# EAGLE design downlink_16_yobi (EAGLE 7.2.0)
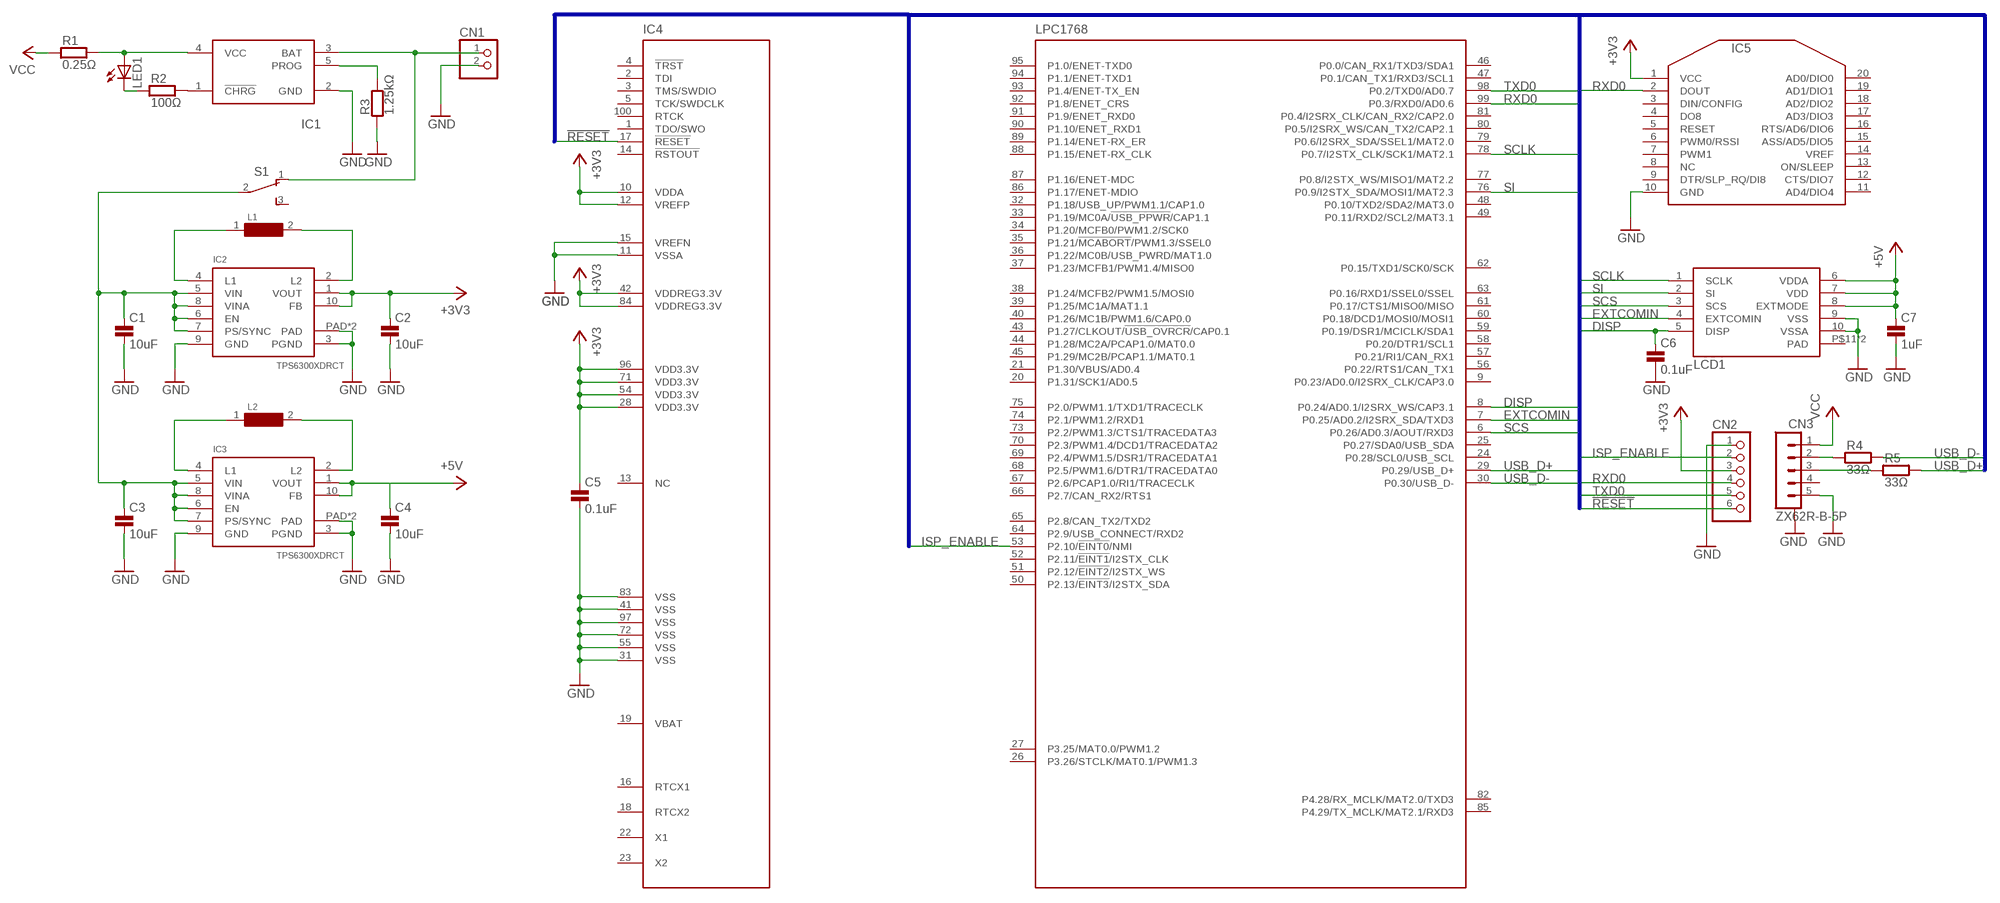
[diagram p0: schematic, sheet 1]

## Parts
C1  10uF  C0603  [0603]
C2  10uF  C0603  [0603]
C3  10uF  C0603  [0603]
C4  10uF  C0603  [0603]
C5  0.1uF  C0603  [0603]
C6  0.1uF  C0603  [0603]
C7  1uF  C0603  [0603]
CN1  PINHD-1X2  [1X02]
CN2  PINHD-1X6/90  [1X06/90]
CN3  ZX62R-B-5P  [MICRO-B]
IC1  LTC4054  [TSOT23-5]
IC2  TPS6300XDRCT  [S-PVSON-N10]
IC3  TPS6300XDRCT  [S-PVSON-N10]
IC4  LPC1768  [LQFP100]
IC5  XBEE-PRO2MM  [XBEE-ZB]
L1  VLF4012ST  [VLF4012ST]
L2  VLF4012ST  [VLF4012ST]
LCD1  LS027B4DH01SMD  [FH12-10S-0.5SH]
LED1  LEDSML0603  [SML0603]
R1  0.25Ω  R0603  [0603]
R2  100Ω  R0603  [0603]
R3  1.25kΩ  R0603  [0603]
R4  33Ω  R0603  [0603]
R5  33Ω  R0603  [0603]
S1  SS-12D00  [SS-12D00]

## Nets
!RESET!: CN2.6 IC4.17(!RESET!)
+3V3: C2.1 C5.1 CN2.3 IC2.1(VOUT) IC2.10(FB) IC4.10(VDDA) IC4.12(VREFP) IC4.28(VDD3.3V) IC4.42(VDDREG3.3V) IC4.54(VDD3.3V) IC4.71(VDD3.3V) IC4.84(VDDREG3.3V) IC4.96(VDD3.3V) IC5.1(VCC)
+5V: C4.1 C7.1 IC3.1(VOUT) IC3.10(FB) LCD1.6(VDDA) LCD1.7(VDD) LCD1.8(EXTMODE)
DISP: C6.1 IC4.8(P0.24/AD0.1/I2SRX_WS/CAP3.1) LCD1.5(DISP)
EXTCOMIN: IC4.7(P0.25/AD0.2/I2SRX_SDA/TXD3) LCD1.4(EXTCOMIN)
GND: C1.2 C2.2 C3.2 C4.2 C5.2 C6.2 C7.2 CN1.2 CN2.1 CN3.5(1.VBUS) CN3.CASE@1 CN3.CASE@2 CN3.CASE@3 CN3.CASE@4 IC1.2(GND) IC2.3(PGND) IC2.9(GND) IC2.PAD IC2.PAD@1(PAD) IC3.3(PGND) IC3.9(GND) IC3.PAD IC3.PAD@1(PAD) IC4.11(VSSA) IC4.15(VREFN) IC4.31(VSS) IC4.41(VSS) IC4.55(VSS) IC4.72(VSS) IC4.83(VSS) IC4.97(VSS) IC5.10(GND) LCD1.9(VSS) LCD1.10(VSSA) R3.1
ISP_ENABLE: CN2.2 IC4.53(P2.10/!EINT0!/NMI)
N$1: CN3.2(4.ID) R4.1
N$2: CN3.3(3.D+) R5.1
N$3: IC1.5(PROG) R3.2
N$4: IC1.4(VCC) LED1.A R1.2
N$5: CN1.1 IC1.3(BAT) S1.1(O)
N$6: IC1.1(!CHRG!) R2.2
N$7: LED1.C R2.1
N$8: IC2.4(L1) L1.1
N$9: IC2.2(L2) L1.2
N$11: IC3.4(L1) L2.1
N$12: IC3.2(L2) L2.2
N$13: C1.1 C3.1 IC2.5(VIN) IC2.6(EN) IC2.7(PS/SYNC) IC2.8(VINA) IC3.5(VIN) IC3.6(EN) IC3.7(PS/SYNC) IC3.8(VINA) S1.2(P)
RXD0: CN2.4 IC4.99(P0.3/RXD0/AD0.6) IC5.2(DOUT)
SCLK: IC4.78(P0.7/I2STX_CLK/SCK1/MAT2.1) LCD1.1(SCLK)
SCS: IC4.6(P0.26/AD0.3/AOUT/RXD3) LCD1.3(SCS)
SI: IC4.76(P0.9/I2STX_SDA/MOSI1/MAT2.3) LCD1.2(SI)
TXD0: CN2.5 IC4.98(P0.2/TXD0/AD0.7)
USB_D+: IC4.29(P0.29/USB_D+) R5.2
USB_D-: IC4.30(P0.30/USB_D-) R4.2
VCC: CN3.1(5.GND) R1.1
Unconnected: CN3.4(2.D-) IC4.1(TDO/SWO) IC4.2(TDI) IC4.3(TMS/SWDIO) IC4.4(!TRST!) IC4.5(TCK/SWDCLK) IC4.9(P0.23/AD0.0/I2SRX_CLK/CAP3.0) IC4.13(NC) IC4.14(!RSTOUT!) IC4.16(RTCX1) IC4.18(RTCX2) IC4.19(VBAT) IC4.20(P1.31/SCK1/AD0.5) IC4.21(P1.30/VBUS/AD0.4) IC4.22(X1) IC4.23(X2) IC4.24(P0.28/SCL0/USB_SCL) IC4.25(P0.27/SDA0/USB_SDA) IC4.26(P3.26/STCLK/MAT0.1/PWM1.3) IC4.27(P3.25/MAT0.0/PWM1.2) IC4.32(P1.18/USB_UP/PWM1.1/CAP1.0) IC4.33(P1.19/MC0A/!USB_PPWR!/CAP1.1) IC4.34(P1.20/MCFB0/PWM1.2/SCK0) IC4.35(P1.21/!MCABORT!/PWM1.3/SSEL0) IC4.36(P1.22/MC0B/USB_PWRD/MAT1.0) IC4.37(P1.23/MCFB1/PWM1.4/MISO0) IC4.38(P1.24/MCFB2/PWM1.5/MOSI0) IC4.39(P1.25/MC1A/MAT1.1) IC4.40(P1.26/MC1B/PWM1.6/CAP0.0) IC4.43(P1.27/CLKOUT/!USB_OVRCR!/CAP0.1) IC4.44(P1.28/MC2A/PCAP1.0/MAT0.0) IC4.45(P1.29/MC2B/PCAP1.1/MAT0.1) IC4.46(P0.0/CAN_RX1/TXD3/SDA1) IC4.47(P0.1/CAN_TX1/RXD3/SCL1) IC4.48(P0.10/TXD2/SDA2/MAT3.0) IC4.49(P0.11/RXD2/SCL2/MAT3.1) IC4.50(P2.13/!EINT3!/I2STX_SDA) IC4.51(P2.12/!EINT2!/I2STX_WS) IC4.52(P2.11/!EINT1!/I2STX_CLK) IC4.56(P0.22/RTS1/CAN_TX1) IC4.57(P0.21/RI1/CAN_RX1) IC4.58(P0.20/DTR1/SCL1) IC4.59(P0.19/DSR1/MCICLK/SDA1) IC4.60(P0.18/DCD1/MOSI0/MOSI1) IC4.61(P0.17/CTS1/MISO0/MISO) IC4.62(P0.15/TXD1/SCK0/SCK) IC4.63(P0.16/RXD1/SSEL0/SSEL) IC4.64(P2.9/USB_CONNECT/RXD2) IC4.65(P2.8/CAN_TX2/TXD2) IC4.66(P2.7/CAN_RX2/RTS1) IC4.67(P2.6/PCAP1.0/RI1/TRACECLK) IC4.68(P2.5/PWM1.6/DTR1/TRACEDATA0) IC4.69(P2.4/PWM1.5/DSR1/TRACEDATA1) IC4.70(P2.3/PWM1.4/DCD1/TRACEDATA2) IC4.73(P2.2/PWM1.3/CTS1/TRACEDATA3) IC4.74(P2.1/PWM1.2/RXD1) IC4.75(P2.0/PWM1.1/TXD1/TRACECLK) IC4.77(P0.8/I2STX_WS/MISO1/MAT2.2) IC4.79(P0.6/I2SRX_SDA/SSEL1/MAT2.0) IC4.80(P0.5/I2SRX_WS/CAN_TX2/CAP2.1) IC4.81(P0.4/I2SRX_CLK/CAN_RX2/CAP2.0) IC4.82(P4.28/RX_MCLK/MAT2.0/TXD3) IC4.85(P4.29/TX_MCLK/MAT2.1/RXD3) IC4.86(P1.17/ENET-MDIO) IC4.87(P1.16/ENET-MDC) IC4.88(P1.15/ENET-RX_CLK) IC4.89(P1.14/ENET-RX_ER) IC4.90(P1.10/ENET_RXD1) IC4.91(P1.9/ENET_RXD0) IC4.92(P1.8/ENET_CRS) IC4.93(P1.4/ENET-TX_EN) IC4.94(P1.1/ENET-TXD1) IC4.95(P1.0/ENET-TXD0) IC4.100(RTCK) IC5.3(DIN/CONFIG) IC5.4(DO8) IC5.5(RESET) IC5.6(PWM0/RSSI) IC5.7(PWM1) IC5.8(NC) IC5.9(DTR/SLP_RQ/DI8) IC5.11(AD4/DIO4) IC5.12(CTS/DIO7) IC5.13(ON/SLEEP) IC5.14(VREF) IC5.15(ASS/AD5/DIO5) IC5.16(RTS/AD6/DIO6) IC5.17(AD3/DIO3) IC5.18(AD2/DIO2) IC5.19(AD1/DIO1) IC5.20(AD0/DIO0) LCD1.P$11(PAD) LCD1.P$12(PAD) S1.3(S)

## Buses
SCLK,SI,SCS,EXTCOMIN,DISP,RXD0,TXD0,!RESET!,ISP_ENABLE,USB_D+,USB_D-

## Library data of the parts
C1-C7 = untitled:C: CAPACITOR
CN1 = pinhead:PINHD-1X2: PIN HEADER
CN2 = pinhead:PINHD-1X6: PIN HEADER
CN3 = untitled:ZX62R-B-5P
IC1 = untitled:LTC4054
IC2 IC3 = untitled:TPS6300XDRCT
IC4 = untitled:LPC1768
IC5 = untitled:XBEE-PRO: XBee
L1 L2 = untitled:VLF4012ST
LCD1 = untitled:LS027B4DH01: LCD
LED1 = led:LED: LED OSRAM: - CHIPLED LG R971, LG N971, LY N971, LG Q971, LY Q971, LO R971, LY R971 LH N974, LH R974 LS Q976, LO Q976, LY Q976 LO Q996 - Hyper CHIPLED LW Q18S LB Q993, LB Q99A, LB R99A - SideLED LS A670, LO A670, LY A670, LG A670, LP A670 LB A673, LV A673, LT A673, LW A673 LH A674 LY A675 LS A676, LA A676, LO A676, LY A676, LW A676 LS A679, LY A679, LG A679 - Hyper Micro SIDELED® LS Y876, LA Y876, LO Y876, LY Y876 LT Y87S - SmartLED LW L88C, LW L88S LB L89C, LB L89S, LG L890 LS L89K, LO L89K, LY L89K LS L896, LA L896, LO L896, LY L896 - TOPLED LS T670, LO T670, LY T670, LG T670, LP T670 LSG T670, LSP T670, LSY T670, LOP T670, LYG T670 LG T671, LOG T671, LSG T671 LB T673, LV T673, LT T673, LW T673 LH T674 LS T676, LA T676, LO T676, LY T676, LB T676, LH T676, LSB T676, LW T676 LB T67C, LV T67C, LT T67C, LS T67K, LO T67K, LY T67K, LW E67C LS E67B, LA E67B, LO E67B, LY E67B, LB E67C, LV E67C, LT E67C LW T67C LS T679, LY T679, LG T679 LS T770, LO T770, LY T770, LG T770, LP T770 LB T773, LV T773, LT T773, LW T773 LH T774 LS E675, LA E675, LY E675, LS T675 LS T776, LA T776, LO T776, LY T776, LB T776 LHGB T686 LT T68C, LB T68C - Hyper Mini TOPLED® LB M676 - Mini TOPLED Santana® LG M470 LS M47K, LO M47K, LY M47K Source: http://www.osram.convergy.de LUXEON: - LUMILED® LXK2-PW12-R00, LXK2-PW12-S00, LXK2-PW14-U00, LXK2-PW14-V00 LXK2-PM12-R00, LXK2-PM12-S00, LXK2-PM14-U00 LXK2-PE12-Q00, LXK2-PE12-R00, LXK2-PE12-S00, LXK2-PE14-T00, LXK2-PE14-U00 LXK2-PB12-K00, LXK2-PB12-L00, LXK2-PB12-M00, LXK2-PB14-N00, LXK2-PB14-P00, LXK2-PB14-Q00 LXK2-PR12-L00, LXK2-PR12-M00, LXK2-PR14-Q00, LXK2-PR14-R00 LXK2-PD12-Q00, LXK2-PD12-R00, LXK2-PD12-S00 LXK2-PH12-R00, LXK2-PH12-S00 LXK2-PL12-P00, LXK2-PL12-Q00, LXK2-PL12-R00 Source: www.luxeon.com KINGBRIGHT: KA-3528ASYC Source: www.kingbright.com
R1-R5 = untitled:R: RESISTOR
S1 = switch-slide:SS-12D00: SLIDE SWITCH

## Board
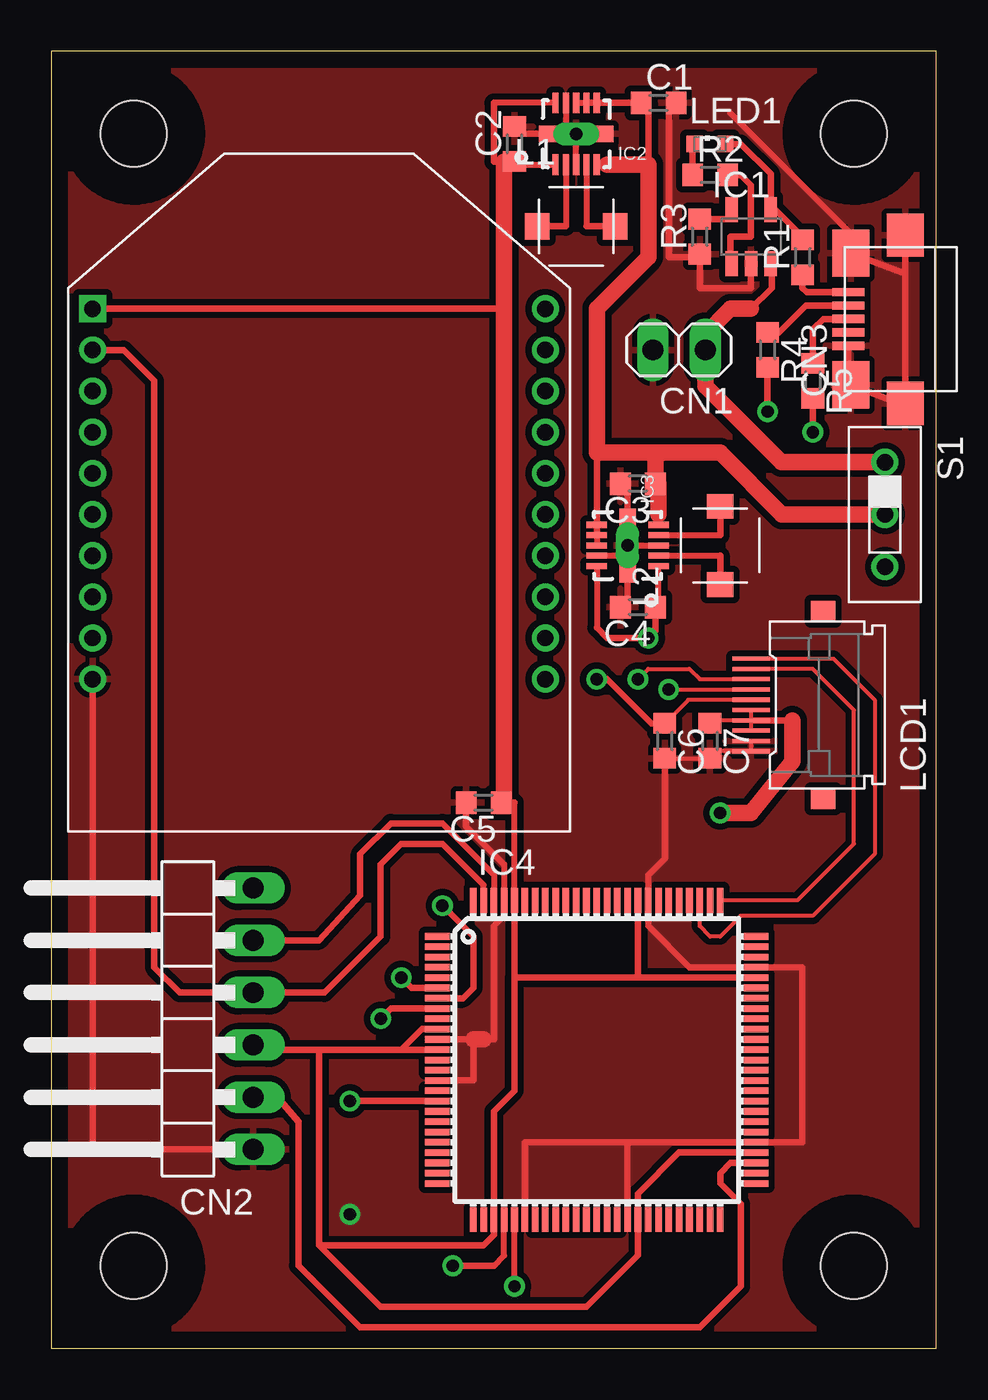
[diagram p1: board, top side]
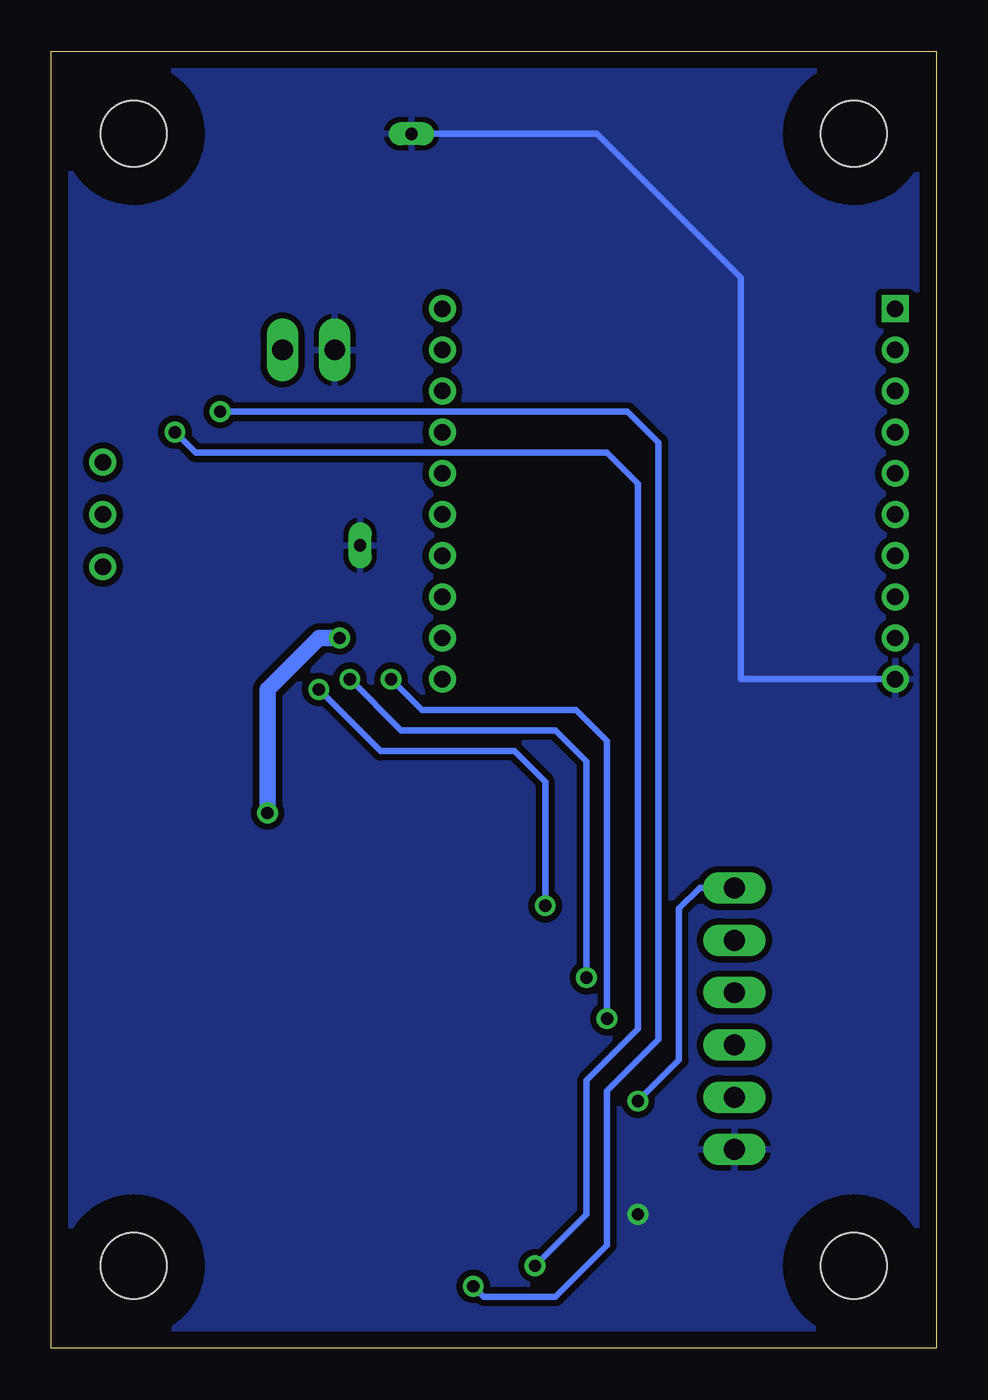
[diagram p2: board, bottom side, seen from below]

Size 43 x 63 mm. Coordinates in mm from the lower left corner, seen from the top.
Outline: 0,0 43,0 43,63 0,63 0,0
Copper layers (1*16): Top 0.035mm / dielectric 1.5mm / Bottom 0.035mm
Design rules "default *": minimum track width 10mil, minimum drill 0.6mm, track to track 0.2mm, track to pad 0.2mm, pad to pad 0.2mm, via to via 0.2mm, smd to smd 0.2mm, copper to edge 32mil, drill to drill 8mil, minimum pad ring 10mil, minimum via ring 8mil, stop-mask expansion 4mil, vias tented up to drill 0mil, thermal gap 10mil
Holes 3.2 mm at 39,59 39,4 4,4 4,59
tRestrict: area 36,56 to 42,62; area 36,1 to 42,7; area 1,1 to 7,7; area 1,56 to 7,62
bRestrict: area 1,1 to 7,7; area 1,56 to 7,62; area 36,56 to 42,62; area 36,1 to 42,7

### Footprints (pad centres in the part's own frame; a part is rotated, then mirrored left to right if it is on the bottom)
0603 = smd 1 x 1.1: 1 -0.85,0; 2 0.85,0
1X02 = drill 1.016 long: 1 -1.27,0; 2 1.27,0
1X06/90 = drill 1.016 long: 1 -6.35,-3.81; 2 -3.81,-3.81; 3 -1.27,-3.81; 4 1.27,-3.81; 5 3.81,-3.81; 6 6.35,-3.81
MICRO-B = smd 0.4 x 1.55: 1 1.3,2.775; 2 0.65,2.775; 3 0,2.775; 4 -0.65,2.775; 5 -1.3,2.775 | smd 2.3 x 1.8: CASE@1 -3.2,2.65; CASE@2 3.2,2.65 | smd 2.1 x 1.8: CASE@3 -4.1,0; CASE@4 4.075,0
TSOT23-5 = smd 0.62 x 1.22: 1 -0.95,-1.31; 2 0,-1.31; 3 0.95,-1.31; 4 0.95,1.31; 5 -0.95,1.31
S-PVSON-N10 = smd 0.3 x 1: 1 -1,-1.5; 2 -0.5,-1.5; 3 0,-1.5; 4 0.5,-1.5; 5 1,-1.5; 6 1,1.5; 7 0.5,1.5; 8 0,1.5; 9 -0.5,1.5; 10 -1,1.5 | smd 3.6 x 0.8: PAD 0,0 | drill 0.6 long: PAD@1 0,0
LQFP100 = smd 1.2 x 0.32: 1 -7.75,6; 2 -7.75,5.5; 3 -7.75,5; 4 -7.75,4.5; 5 -7.75,4; 6 -7.75,3.5; 7 -7.75,3; 8 -7.75,2.5; 9 -7.75,2; 10 -7.75,1.5; 11 -7.75,1; 12 -7.75,0.5; 13 -7.75,0; 14 -7.75,-0.5; 15 -7.75,-1; 16 -7.75,-1.5; 17 -7.75,-2; 18 -7.75,-2.5; 19 -7.75,-3; 20 -7.75,-3.5; 21 -7.75,-4; 22 -7.75,-4.5; 23 -7.75,-5; 24 -7.75,-5.5; 25 -7.75,-6; 51 7.75,-6; 52 7.75,-5.5; 53 7.75,-5; 54 7.75,-4.5; 55 7.75,-4; 56 7.75,-3.5; 57 7.75,-3; 58 7.75,-2.5; 59 7.75,-2; 60 7.75,-1.5; 61 7.75,-1; 62 7.75,-0.5; 63 7.75,0; 64 7.75,0.5; 65 7.75,1; 66 7.75,1.5; 67 7.75,2; 68 7.75,2.5; 69 7.75,3; 70 7.75,3.5; 71 7.75,4; 72 7.75,4.5; 73 7.75,5; 74 7.75,5.5; 75 7.75,6 | smd 0.32 x 1.2: 26 -6,-7.75; 27 -5.5,-7.75; 28 -5,-7.75; 29 -4.5,-7.75; 30 -4,-7.75; 31 -3.5,-7.75; 32 -3,-7.75; 33 -2.5,-7.75; 34 -2,-7.75; 35 -1.5,-7.75; 36 -1,-7.75; 37 -0.5,-7.75; 38 0,-7.75; 39 0.5,-7.75; 40 1,-7.75; 41 1.5,-7.75; 42 2,-7.75; 43 2.5,-7.75; 44 3,-7.75; 45 3.5,-7.75; 46 4,-7.75; 47 4.5,-7.75; 48 5,-7.75; 49 5.5,-7.75; 50 6,-7.75; 76 6,7.75; 77 5.5,7.75; 78 5,7.75; 79 4.5,7.75; 80 4,7.75; 81 3.5,7.75; 82 3,7.75; 83 2.5,7.75; 84 2,7.75; 85 1.5,7.75; 86 1,7.75; 87 0.5,7.75; 88 0,7.75; 89 -0.5,7.75; 90 -1,7.75; 91 -1.5,7.75; 92 -2,7.75; 93 -2.5,7.75; 94 -3,7.75; 95 -3.5,7.75; 96 -4,7.75; 97 -4.5,7.75; 98 -5,7.75; 99 -5.5,7.75; 100 -6,7.75
XBEE-ZB = drill 0.8 square: 1 -11,18 | drill 0.8: 2 -11,16; 3 -11,14; 4 -11,12; 5 -11,10; 6 -11,8; 7 -11,6; 8 -11,4; 9 -11,2; 10 -11,0; 11 11,0; 12 11,2; 13 11,4; 14 11,6; 15 11,8; 16 11,10; 17 11,12; 18 11,14; 19 11,16; 20 11,18
VLF4012ST = smd 1.2 x 1.3: 1 1.9,0; 2 -1.9,0
FH12-10S-0.5SH = smd 0.2 x 1.8: 1 4.5,1; 2 4,1; 3 3.5,1; 4 3,1; 5 2.5,1; 6 2,1; 7 1.5,1; 8 1,1; 9 0.5,1; 10 0,1 | smd 1 x 1.2: P$11 -2.3,-2.5; P$12 6.8,-2.5
SML0603 = smd 0.8 x 0.8: A 0.75,0; C -0.75,0
SS-12D00 = drill 0.8: 1 -2.54,0; 2 0,0; 3 2.54,0

### Placement (x,y rotation side)
C1  29.5,60.5 0 top
C2  22.5,58.5 90 top
C3  28.5,42 180 top
C4  28.5,36 180 top
C5  21,26.5 180 top
C6  29.8,29.5 270 top
C7  32,29.5 270 top
CN1  30.5,48.5 180 top
CN2  6,16 90 top
CN3  41.5,50 90 top
IC1  34,54 0 top
IC2  25.5,59 0 top
IC3  28,39 90 top
IC4  26.5,14 0 top
IC5  13,32.5 0 top
L1  25.5,54.5 0 top
L2  32.5,39 90 top
LCD1  35,29 90 top
LED1  32,58.5 0 top
R1  36.5,53 90 top
R2  32,57 0 top
R3  31.5,54 90 top
R4  34.8,48.5 270 top
R5  37,47 270 top
S1  40.5,40.5 270 top

### Tracks (layer width: path | path; a pad name or v marks a point on that pad's centre or on a via)
!RESET!  (via drill 0.6)
  Top 0.305: IC4.17 v14.5,12
  Bottom 0.305: v14.5,12 12.5,14 12.5,21.35 11.5,22.35 CN2.6
+3V3
  Top 0.3: IC2.10 21.5,60.5 | 22.5,57.5 IC2.1 | IC4.96 22.5,26.5
  Top 0.305: 21.5,60.5 21.5,57.65 22,57.65 | C2.1 22.5,57.5 | IC4.84 28.5,18 | 28.5,18 IC4.71 | IC4.54 30.5,9.5 28.5,7.5 IC4.42 28.5,4.5 26,2 16,2 13,5 | 13,14.5 9.81,14.5 CN2.3 | IC4.10 18,15.5 17,14.5 | IC4.96 22.5,18 | 22.5,18 28.5,18 | 22.5,18 22.5,12.5 21.5,11.5 21.5,11 IC4.28 21.5,5.5 21,5 13,5 | 22,50.5 IC5.1 | IC4.12 17,14.5 | 17,14.5 13,14.5 | 13,14.5 13,5 | 22.5,26.5 C5.1
  Top 0.813: C2.1 22,57.65 22,50.5 22,26.5 C5.1
+5V  (via drill 0.6)
  Top 0.203: LCD1.7 LCD1.8 | LCD1.7 32,30.5 C7.1 | LCD1.6 LCD1.7
  Top 0.3: 29.5,36 IC3.1 | IC3.10 26.5,35
  Top 0.305: 29.5,36 C4.1 29.35,34.85 v29,34.5 27,34.5 26.5,35 | LCD1.7 36,30.5
  Top 0.813: 36,30.5 36,28.5 34,26 v32.5,26
  Bottom 0.813: v32.5,26 32.5,32 30,34.5 v29,34.5
DISP  (via drill 0.6)
  Top 0.203: LCD1.5 30.95,31.5 C6.1
  Top 0.305: IC4.8 16.5,16.5 v16,16 | C6.1 29.15,30.35 27,32.5 v26.5,32.5
  Bottom 0.305: v26.5,32.5 25,31 17.5,31 16,29.5 v16,16
EXTCOMIN  (via drill 0.6)
  Top 0.203: v30,32 LCD1.4
  Top 0.305: IC4.7 20,17 20.5,17.5 20.5,20 v19,21.5
  Bottom 0.305: v19,21.5 19,27.5 20.5,29 27,29 v30,32
GND  (via drill 0.6)
  Top 0.203: LCD1.9 LCD1.10 32.5,29 | 32.5,29 32,29 C7.2 | C6.2 32.15,28.65 32.5,29
  Top 0.3: IC3.PAD@1 IC3.3 | IC3.9 28,38.5 | IC2.9 25,59 | IC2.3 IC2.PAD@1 | 20.15,25.35 22,23.5 IC4.97
  Top 0.305: C4.2 28,36 28,38.5 IC3.PAD@1 28,42 C3.2 | IC1.2 34,51.5 31.5,51.5 R3.1 31.5,53 30,53 30,60.5 | 22.5,59.5 C2.2 22.5,59 25,59 IC2.PAD@1 | IC4.41 28,10 | 28,10 IC4.55 36.5,10 36.5,18.5 IC4.72 31,18.5 29,20.5 IC4.83 29,23 29.8,23.8 C6.2 | 20.5,15 20.5,13 IC4.15 | IC4.31 23,10 28,10 | IC5.10 2,9.65 CN2.1 | CN3.5 38.73,45.8 CN3.CASE@1 41.5,45.8 CN3.CASE@3 CN3.CASE@4 41.5,52.2 CN3.CASE@2 38.85,54.15 33,60 | IC4.97 22,21 21.5,20.5 21.5,15 21,15 IC4.11 | C5.2 20.15,25.35
  Top 0.813: 20.5,15 21,15
  Bottom 0.305: IC5.10 9.5,32.5 9.5,52 16.5,59 IC2.PAD@1
  other vias: 14.5,6.5
  pour Top (isolate 0.305): 0,63 43,63 43,0 0,0
  pour Bottom (isolate 0.305): 0,63 43,63 43,0 0,0
ISP_ENABLE
  Top 0.305: CN2.2 11,12.19 12,11 12,4 15,1 31.5,1 33.5,3 33.5,7 32.5,8 32.5,8.5 33,9 IC4.53
N$1
  Top 0.305: CN3.2 36.65,50.65 35.35,49.35 R4.1
N$2
  Top 0.305: CN3.3 37.5,50 37,49.5 R5.1
N$3
  Top 0.305: R3.2 33.05,54.85 IC1.5
N$4
  Top 0.305: R1.2 36.5,54 35.19,55.31 IC1.4 34.95,57.05 33.5,58.5 LED1.A
N$5
  Top 0.305: IC1.3 35,52.64 35,51.5 34,50.5
  Top 0.813: S1.1 35.46,43.04 31.77,46.73 CN1.1 31.77,49.27 33,50.5 34,50.5
N$6
  Top 0.305: IC1.1 33,52.69 33,54 34,54 34,56.5 33.5,57 R2.2
N$7
  Top 0.305: R2.1 31.15,58.5 LED1.C
N$8
  Top 0.3: IC2.4 26,54.5
  Top 0.305: 26,54.5 L1.1
N$9
  Top 0.3: IC2.2 25,54.5
  Top 0.305: 25,54.5 L1.2
N$11
  Top 0.3: IC3.4 32.5,39.5
  Top 0.305: 32.5,39.5 L2.1
N$12
  Top 0.3: IC3.2 32.5,38.5
  Top 0.305: 32.5,38.5 L2.2
N$13
  Top 0.3: 29.5,40.5 IC3.5 | IC2.8 IC2.7 | IC2.5 27,57.5 | IC3.7 IC3.8
  Top 0.305: IC3.7 IC3.6 26.5,43.5 27,43.5 | IC2.7 IC2.6 C1.1 29,60.5 29,57.5 | 26.45,50.45 26.5,50.5 | C3.1 29.5,42
  Top 0.813: 29.5,42 29.5,40.5 | 27,57.5 29,57.5 29,53 26.5,50.5 26.5,43.5 29.5,43.5 | C3.1 29.35,43.15 29.5,43.5 | S1.2 35.5,40.5 32.5,43.5 29.5,43.5
RXD0
  Top 0.3: IC4.99 21,22.5 19,24.5
  Top 0.305: 19,24.5 17,24.5 16,23.5 16,20 13.27,17.27 CN2.4 6.23,17.27 5,18.5 5,47 3.5,48.5 IC5.2
SCLK
  Top 0.203: LCD1.1 38,33.5 40,31.5 40,24 37,21 33.5,21 32.5,20 32,20 31.5,20.5 IC4.78
SCS  (via drill 0.6)
  Top 0.203: v28.5,32.5 29,33 31,33 31.5,32.5 LCD1.3
  Top 0.305: IC4.6 17.5,17.5 v17,18
  Bottom 0.305: v17,18 17,28.5 18.5,30 26,30 v28.5,32.5
SI
  Top 0.203: LCD1.2 37,33 39,31 39,24.5 36.25,21.75 IC4.76
TXD0
  Top 0.3: 19,25.5 21.5,23 IC4.98
  Top 0.305: CN2.5 13,19.81 15,22 15,24 16.5,25.5 19,25.5
USB_D+  (via drill 0.6)
  Top 0.3: 21.5,4 22,4.5 IC4.29
  Top 0.305: R5.2 v37,44.5 | v19.5,4 21.5,4
  Bottom 0.305: v37,44.5 36,43.5 16,43.5 14.5,42 14.5,15.5 17,13 17,6.5 v19.5,4
USB_D-  (via drill 0.6)
  Top 0.3: v22.5,3 IC4.30
  Top 0.305: R4.2 v34.8,45.5
  Bottom 0.305: v34.8,45.5 15,45.5 13.5,44 13.5,15 16,12.5 16,5 18.5,2.5 22,2.5 v22.5,3
VCC
  Top 0.305: CN3.1 36.7,51.3 36.5,51.5 R1.1